# Altium schematic sheet QCopterRC_USB_Sch.SchDoc
size A4
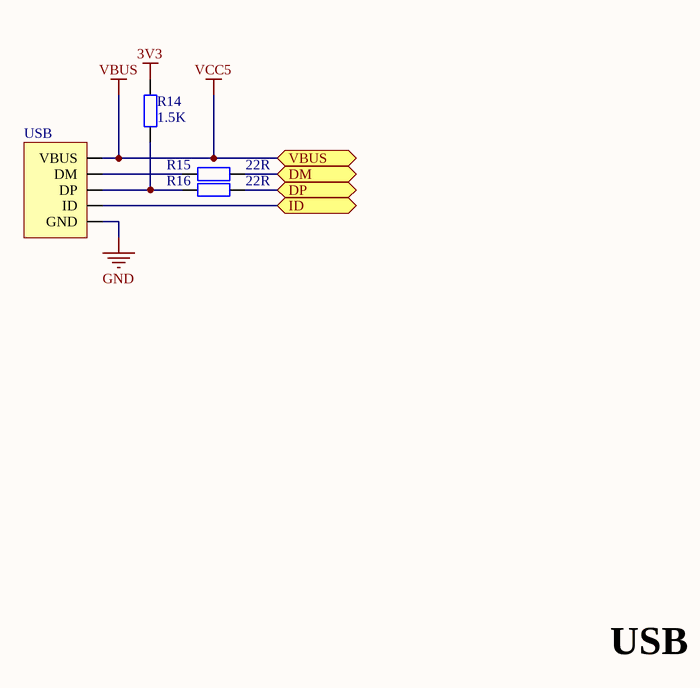
[diagram p0: QCopterRC_USB_Sch.SchDoc]

## Parts
R14  value 1.5K  [RES_0603]  (hidden comment: Res_0603)
R15  value 22R  [RES_0603]  (hidden comment: Res_0603)
R16  value 22R  [RES_0603]  (hidden comment: Res_0603)
USB  USB_Micro  [USB_MICRO_B]  (value not drawn)

## Ports
DM, DP, ID, VBUS

## Nets
3V3: R14.2
GND: USB.5(GND)
VBUS: USB.1(VBUS) ; port VBUS  [also labelled VCC5]
DM: R15.2 ; port DM
DP: R16.2 ; port DP
ID: USB.4(ID) ; port ID
NetR14_1: R14.1 R16.1 USB.3(DP)
NetR15_1: R15.1 USB.2(DM)

## Notes on the sheet
- USB

## Library data of the parts
R14-R16 = Res_0603: Resistor
USB = USB_Micro: USB